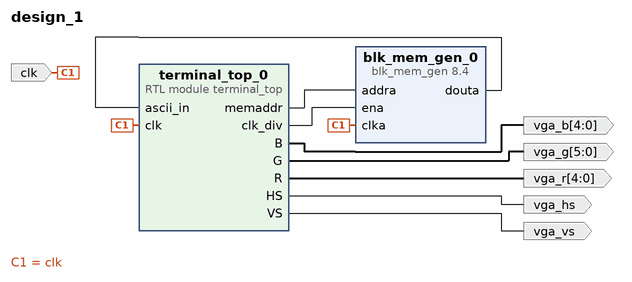
[diagram p0: block diagram of the top level]
# Vivado block design design_1, xc7z010clg400-2, Vivado 2018.3
create_bd_design design_1

create_bd_port -dir I -type clk clk
create_bd_port -dir O -from 4 -to 0 vga_r
create_bd_port -dir O -from 5 -to 0 vga_g
create_bd_port -dir O -from 4 -to 0 vga_b
create_bd_port -dir O vga_hs
create_bd_port -dir O vga_vs

create_bd_cell -type ip -vlnv xilinx.com:ip:blk_mem_gen:8.4 blk_mem_gen_0
set_property -dict [list \
  CONFIG.Enable_32bit_Address false \
  CONFIG.Enable_A Use_ENA_Pin \
  CONFIG.Fill_Remaining_Memory_Locations true \
  CONFIG.Load_Init_File false \
  CONFIG.Read_Width_A 8 \
  CONFIG.Register_PortA_Output_of_Memory_Primitives false \
  CONFIG.Remaining_Memory_Locations 30 \
  CONFIG.Use_Byte_Write_Enable false \
  CONFIG.Use_RSTA_Pin false \
  CONFIG.Write_Depth_A 2400 \
  CONFIG.Write_Width_A 8 \
  CONFIG.use_bram_block Stand_Alone \
] [get_bd_cells blk_mem_gen_0]
create_bd_cell -type module -reference terminal_top terminal_top_0

# ---- connections ----

connect_bd_net [get_bd_pins terminal_top_0/memaddr] [get_bd_pins blk_mem_gen_0/addra]
connect_bd_net [get_bd_pins blk_mem_gen_0/douta] [get_bd_pins terminal_top_0/ascii_in]
connect_bd_net [get_bd_pins terminal_top_0/clk_div] [get_bd_pins blk_mem_gen_0/ena]
connect_bd_net [get_bd_pins terminal_top_0/R] [get_bd_ports vga_r]
connect_bd_net [get_bd_pins terminal_top_0/G] [get_bd_ports vga_g]
connect_bd_net [get_bd_pins terminal_top_0/B] [get_bd_ports vga_b]
connect_bd_net [get_bd_pins terminal_top_0/HS] [get_bd_ports vga_hs]
connect_bd_net [get_bd_pins terminal_top_0/VS] [get_bd_ports vga_vs]
connect_bd_net [get_bd_ports clk] [get_bd_pins blk_mem_gen_0/clka] [get_bd_pins terminal_top_0/clk]

validate_bd_design
save_bd_design
